# Altium schematic sheet config-bank3.SchDoc: Config FPGA - Bank 3
size Letter; CheckedBy: E. Chiu; CompanyName: Brinton Engineering, LLC; DrawnBy: J. Brinton; Engineer: J. Brinton; Address1: 3479 Edison Way; Address2: Menlo Park CA 94025; Address3: +1 (877) 778-8435; Address4: brintonengineering.com; Revision: 1; SheetNumber: 21; SheetTotal: 71
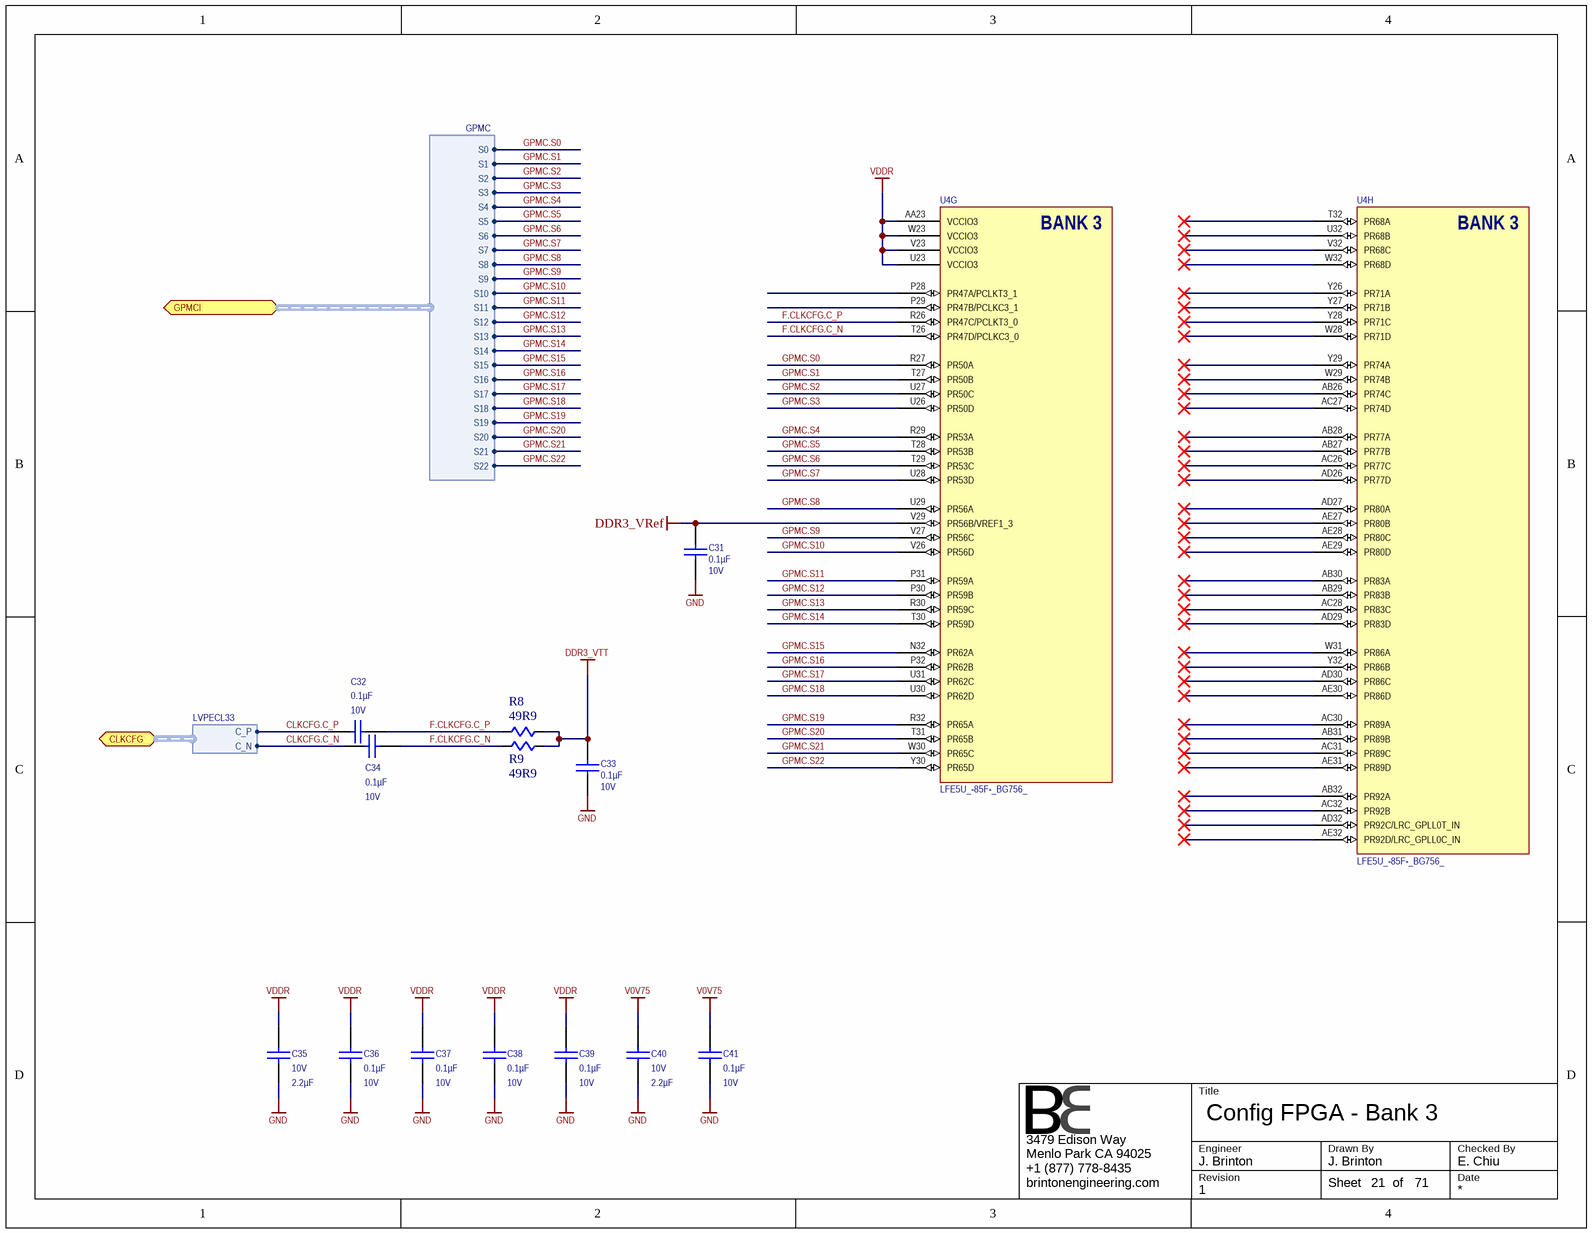
[diagram p0: config-bank3.SchDoc]

## Parts
C31  Capacitance: 0.1µF  Voltage - Rated: 10V  [CAPC1005X56N]  (hidden comment: GRM155R71A104KA01J)
C32  Capacitance: 0.1µF  Voltage - Rated: 10V  [CAPC1005X56N]  (hidden comment: GRM155R71A104KA01J)
C33  Capacitance: 0.1µF  Voltage - Rated: 10V  [CAPC1005X56N]  (hidden comment: GRM155R71A104KA01J)
C34  Capacitance: 0.1µF  Voltage - Rated: 10V  [CAPC1005X56N]  (hidden comment: GRM155R71A104KA01J)
C35  Voltage - Rated: 10V  Capacitance: 2.2µF  [CAPC1608X90N]  (hidden comment: GRM188R71A225KE15D)
C36  Capacitance: 0.1µF  Voltage - Rated: 10V  [CAPC1005X56N]  (hidden comment: GRM155R71A104KA01J)
C37  Capacitance: 0.1µF  Voltage - Rated: 10V  [CAPC1005X56N]  (hidden comment: GRM155R71A104KA01J)
C38  Capacitance: 0.1µF  Voltage - Rated: 10V  [CAPC1005X56N]  (hidden comment: GRM155R71A104KA01J)
C39  Capacitance: 0.1µF  Voltage - Rated: 10V  [CAPC1005X56N]  (hidden comment: GRM155R71A104KA01J)
C40  Voltage - Rated: 10V  Capacitance: 2.2µF  [CAPC1608X90N]  (hidden comment: GRM188R71A225KE15D)
C41  Capacitance: 0.1µF  Voltage - Rated: 10V  [CAPC1005X56N]  (hidden comment: GRM155R71A104KA01J)
R8  value 49R9  [RESC1005N-0402]  (hidden comment: Res 49.9R 1/10W 1% 0402)
R9  value 49R9  [RESC1005N-0402]  (hidden comment: Res 49.9R 1/10W 1% 0402)
U4  LFE5U_-85F-_BG756_  [caBGA756]  (parts G,H of 19)

## Ports
CLKCFG (harness LVPECL33), GPMCI (harness GPMC)

## Harnesses
GPMC: S0, S1, S2, S3, S4, S5, S6, S7, S8, S9, S10, S11, S12, S13, S14, S15, S16, S17, S18, S19, S20, S21, S22
LVPECL33: C_P, C_N

## Nets
DDR3_VRef: C31.1 U4.V29(PR56B/VREF1_3)
DDR3_VTT: C33.2 R8.2 R9.2
GND: C31.2 C33.1 C35.1 C36.1 C37.1 C38.1 C39.1 C40.1 C41.1
V0V75: C40.2 C41.2
VDDR: C35.2 C36.2 C37.2 C38.2 C39.2 U4.AA23(VCCIO3) U4.U23(VCCIO3) U4.V23(VCCIO3) U4.W23(VCCIO3)
CLKCFG.C_N: C34.2 ; port CLKCFG.C_N
CLKCFG.C_P: C32.2 ; port CLKCFG.C_P
F.CLKCFG.C_N: C34.1 R9.1 U4.T26(PR47D/PCLKC3_0)
F.CLKCFG.C_P: C32.1 R8.1 U4.R26(PR47C/PCLKT3_0)
GPMC.S0: U4.R27(PR50A) ; port GPMCI.S0
GPMC.S1: U4.T27(PR50B) ; port GPMCI.S1
GPMC.S2: U4.U27(PR50C) ; port GPMCI.S2
GPMC.S3: U4.U26(PR50D) ; port GPMCI.S3
GPMC.S4: U4.R29(PR53A) ; port GPMCI.S4
GPMC.S5: U4.T28(PR53B) ; port GPMCI.S5
GPMC.S6: U4.T29(PR53C) ; port GPMCI.S6
GPMC.S7: U4.U28(PR53D) ; port GPMCI.S7
GPMC.S8: U4.U29(PR56A) ; port GPMCI.S8
GPMC.S9: U4.V27(PR56C) ; port GPMCI.S9
GPMC.S10: U4.V26(PR56D) ; port GPMCI.S10
GPMC.S11: U4.P31(PR59A) ; port GPMCI.S11
GPMC.S12: U4.P30(PR59B) ; port GPMCI.S12
GPMC.S13: U4.R30(PR59C) ; port GPMCI.S13
GPMC.S14: U4.T30(PR59D) ; port GPMCI.S14
GPMC.S15: U4.N32(PR62A) ; port GPMCI.S15
GPMC.S16: U4.P32(PR62B) ; port GPMCI.S16
GPMC.S17: U4.U31(PR62C) ; port GPMCI.S17
GPMC.S18: U4.U30(PR62D) ; port GPMCI.S18
GPMC.S19: U4.R32(PR65A) ; port GPMCI.S19
GPMC.S20: U4.T31(PR65B) ; port GPMCI.S20
GPMC.S21: U4.W30(PR65C) ; port GPMCI.S21
GPMC.S22: U4.Y30(PR65D) ; port GPMCI.S22

Not connected (* = marked no-connect by the designer): U4 AB26(PR74C)* AB27(PR77B)* AB28(PR77A)* AB29(PR83B)* AB30(PR83A)* AB31(PR89B)* AB32(PR92A)* AC26(PR77C)* AC27(PR74D)* AC28(PR83C)* AC30(PR89A)* AC31(PR89C)* AC32(PR92B)* AD26(PR77D)* AD27(PR80A)* AD29(PR83D)* AD30(PR86C)* AD32(PR92C/LRC_GPLL0T_IN)* AE27(PR80B)* AE28(PR80C)* AE29(PR80D)* AE30(PR86D)* AE31(PR89D)* AE32(PR92D/LRC_GPLL0C_IN)* P28(PR47A/PCLKT3_1) P29(PR47B/PCLKC3_1) T32(PR68A)* U32(PR68B)* V32(PR68C)* W28(PR71D)* W29(PR74B)* W31(PR86A)* W32(PR68D)* Y26(PR71A)* Y27(PR71B)* Y28(PR71C)* Y29(PR74A)* Y32(PR86B)*

## Notes on the sheet
- Title
- Engineer
- Revision
- Drawn By
- Checked By
- Date
- Sheet
- of
- (in symbol LFE5U_-85F-_BG756_, part G) BANK 3
- (in symbol LFE5U_-85F-_BG756_, part H) BANK 3

## Library data of the parts
C31-C34 C36-C39 C41 = GRM155R71A104KA01J: CAP CER 0.1UF 10V 10% X7R 0402; Manufacturer: Murata Electronics North America; Manufacturer P/N: GRM155R71A104KA01J; Operating Temperature: -55°C ~ 125°C; Thickness (Max): 0.022" (0.55mm); Size / Dimension: 0.039" L x 0.020" W (1.00mm x 0.50mm); RoHS: RoHS Compliant; Mounting Type: Surface Mount, MLCC; Supplier 1: Digi-Key; ComponentLink1URL: http://www.murata.com/~/media/webrenewal/support/library/catalog/products/capacitor/mlcc/c02e.ashx; ComponentLink1Description: http://www.murata.com/~/media/webrenewal/support/library/catalog/products/capacitor/mlcc/c02e.ashx; Supplier Part Number 1: 490-6322-1-ND; Temperature Coefficient: X7R; Package / Case: 0402 (1005 Metric); Tolerance: ±10%
C35 C40 = GRM188R71A225KE15D: CAP CER 2.2UF 10V 10% X7R 0603; Manufacturer: Murata Electronics North America; Manufacturer P/N: GRM188R71A225KE15D; Operating Temperature: -55°C ~ 125°C; Thickness (Max): 0.035" (0.90mm); Tolerance: ±10%; Package / Case: 0603 (1608 Metric); Temperature Coefficient: X7R; Supplier 1: Newark; Supplier 2: Digi-Key; RoHS: RoHS Compliant; Size / Dimension: 0.063" L x 0.031" W (1.60mm x 0.80mm); Mounting Type: Surface Mount, MLCC; ComponentLink1URL: http://www.murata.com/~/media/webrenewal/support/library/catalog/products/capacitor/mlcc/c02e.ashx; ComponentLink1Description: http://www.murata.com/~/media/webrenewal/support/library/catalog/products/capacitor/mlcc/c02e.ashx; Supplier Part Number 1: 72R4209; Supplier Part Number 2: 490-4520-1-ND
R8 R9 = ERJ-2RKF49R9X: Dist: Digi-Key; Dist P/N: P49.9LCT-ND; Mfg: Panasonic; Mfgr P/N: ERJ-2RKF49R9X; Price: 0.05; Datasheet: http://industrial.panasonic.com/www-cgi/jvcr13pz.cgi?E+PZ+3+AOA0002+ERJ3EKF22R1V+7+WW
U4 = LFE5U_-85F-_BG756_: ECP5 FPGA, 85k LUT, 756-caBGA; Manufacturer: Lattice Semiconductor; Manufacturer P/N: LFE5U_-85F-_BG756_